# Altium schematic sheet 03_electrode_interface_new.SchDoc
size A3
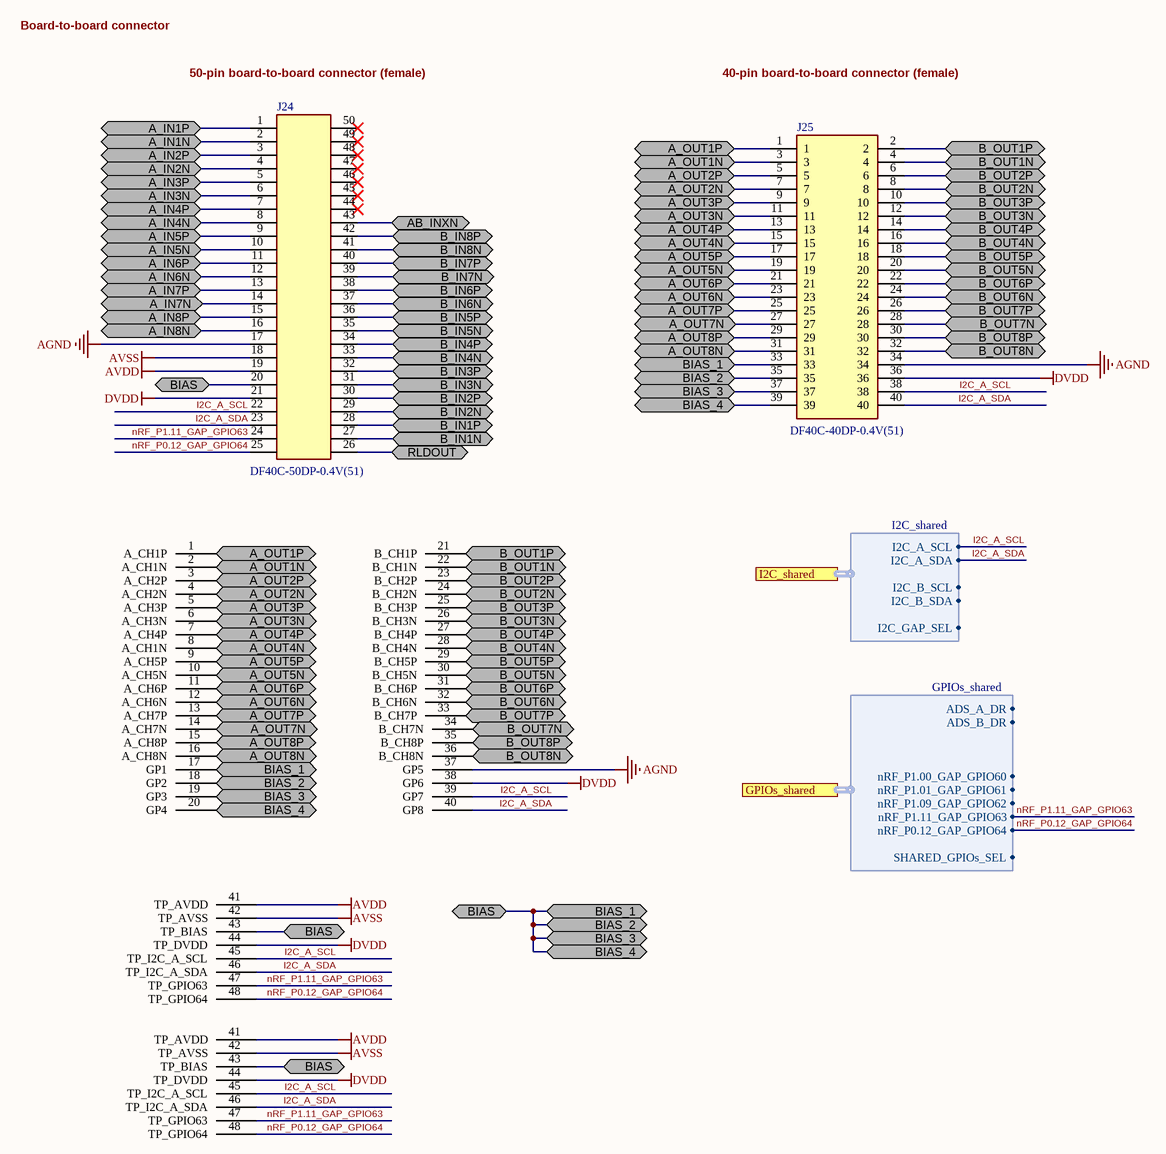
[diagram p0: 03_electrode_interface_new.SchDoc]

## Parts
AGND  0603_pad1_37  [0603_PAD_2 - duplicate37]  (value not drawn)
BIAS_1  0603_pad1_17  [0603_PAD_2 - duplicate17]  (value not drawn)
BIAS_2  0603_pad1_18  [0603_PAD_2 - duplicate18]  (value not drawn)
BIAS_3  0603_pad1_19  [0603_PAD_2 - duplicate19]  (value not drawn)
BIAS_4  0603_pad1_20  [0603_PAD_2 - duplicate20]  (value not drawn)
DVDD  0603_pad1_38  [0603_PAD_2 - duplicate38]  (value not drawn)
I2C_A_SCL  0603_pad1_39  [0603_PAD_2 - duplicate39]  (value not drawn)
I2C_A_SDA  0603_pad1_40  [0603_PAD_2 - duplicate40]  (value not drawn)
J24  DF40C-50DP-0.4V(51)  [CONN_COMBI_50P]
J25  DF40C-40DP-0.4V(51)  [FP-DF40C-40DP-0_4V_51-MFG]
J_A1N  0603_pad1_2  [0603_PAD_2 - duplicate2]  (value not drawn)
J_A1P  0603_pad1_1  [0603_PAD_2 - duplicate1]  (value not drawn)
J_A2N  0603_pad1_4  [0603_PAD_2 - duplicate4]  (value not drawn)
J_A2P  0603_pad1_3  [0603_PAD_2 - duplicate3]  (value not drawn)
J_A3N  0603_pad1_6  [0603_PAD_2 - duplicate6]  (value not drawn)
J_A3P  0603_pad1_5  [0603_PAD_2 - duplicate5]  (value not drawn)
J_A4N  0603_pad1_8  [0603_PAD_2 - duplicate8]  (value not drawn)
J_A4P  0603_pad1_7  [0603_PAD_2 - duplicate7]  (value not drawn)
J_A5N  0603_pad1_10  [0603_PAD_2 - duplicate10]  (value not drawn)
J_A5P  0603_pad1_9  [0603_PAD_2 - duplicate9]  (value not drawn)
J_A6N  0603_pad1_12  [0603_PAD_2 - duplicate12]  (value not drawn)
J_A6P  0603_pad1_11  [0603_PAD_2 - duplicate11]  (value not drawn)
J_A7N  0603_pad1_14  [0603_PAD_2 - duplicate14]  (value not drawn)
J_A7P  0603_pad1_13  [0603_PAD_2 - duplicate13]  (value not drawn)
J_A8N  0603_pad1_16  [0603_PAD_2 - duplicate16]  (value not drawn)
J_A8P  0603_pad1_15  [0603_PAD_2 - duplicate15]  (value not drawn)
J_B1N  0603_pad1_22  [0603_PAD_2 - duplicate22]  (value not drawn)
J_B1P  0603_pad1_21  [0603_PAD_2 - duplicate21]  (value not drawn)
J_B2N  0603_pad1_24  [0603_PAD_2 - duplicate24]  (value not drawn)
J_B2P  0603_pad1_23  [0603_PAD_2 - duplicate23]  (value not drawn)
J_B3N  0603_pad1_26  [0603_PAD_2 - duplicate26]  (value not drawn)
J_B3P  0603_pad1_25  [0603_PAD_2 - duplicate25]  (value not drawn)
J_B4N  0603_pad1_28  [0603_PAD_2 - duplicate28]  (value not drawn)
J_B4P  0603_pad1_27  [0603_PAD_2 - duplicate27]  (value not drawn)
J_B5N  0603_pad1_30  [0603_PAD_2 - duplicate30]  (value not drawn)
J_B5P  0603_pad1_29  [0603_PAD_2 - duplicate29]  (value not drawn)
J_B6N  0603_pad1_32  [0603_PAD_2 - duplicate32]  (value not drawn)
J_B6P  0603_pad1_31  [0603_PAD_2 - duplicate31]  (value not drawn)
J_B7N  0603_pad1_34  [0603_PAD_2 - duplicate34]  (value not drawn)
J_B7P  0603_pad1_33  [0603_PAD_2 - duplicate33]  (value not drawn)
J_B8N  0603_pad1_36  [0603_PAD_2 - duplicate36]  (value not drawn)
J_B8P  0603_pad1_35  [0603_PAD_2 - duplicate35]  (value not drawn)
TP_AVDD  TP_AVDD  [TP_AVDD]  (value not drawn)
TP_AVDD_1  TP_AVDD  [TP_AVDD]  (value not drawn)
TP_AVSS  TP_AVSS  [TP_AVSS]  (value not drawn)
TP_AVSS_1  TP_AVSS  [TP_AVSS]  (value not drawn)
TP_BIAS  TP_BIAS  [TP_BIAS]  (value not drawn)
TP_BIAS_1  TP_BIAS  [TP_BIAS]  (value not drawn)
TP_DVDD  TP_DVDD  [TP_DVDD]  (value not drawn)
TP_DVDD_1  TP_DVDD  [TP_DVDD]  (value not drawn)
TP_GPIO63  TP_GPIO63  [TP_GPIO63]  (value not drawn)
TP_GPIO63_1  TP_GPIO63  [TP_GPIO63]  (value not drawn)
TP_GPIO64  TP_GPIO64  [TP_GPIO64]  (value not drawn)
TP_GPIO64_1  TP_GPIO64  [TP_GPIO64]  (value not drawn)
TP_I2C_A_SCL  TP_I2C_A_SCL  [TP_I2C_A_SCL]  (value not drawn)
TP_I2C_A_SCL_1  TP_I2C_A_SCL  [TP_I2C_A_SCL]  (value not drawn)
TP_I2C_A_SDA  TP_I2C_A_SDA  [TP_I2C_A_SDA]  (value not drawn)
TP_I2C_A_SDA_1  TP_I2C_A_SDA  [TP_I2C_A_SDA]  (value not drawn)

## Ports
A_IN1N (bidir), A_IN1P (bidir), A_IN2N (bidir), A_IN2P (bidir), A_IN3N (bidir), A_IN3P (bidir), A_IN4N (bidir), A_IN4P (bidir), A_IN5N (bidir), A_IN5P (bidir), A_IN6N (bidir), A_IN6P (bidir), A_IN7N (bidir), A_IN7P (bidir), A_IN8N (bidir), A_IN8P (bidir), A_OUT1N (bidir), A_OUT1P (bidir), A_OUT2N (bidir), A_OUT2P (bidir), A_OUT3N (bidir), A_OUT3P (bidir), A_OUT4N (bidir), A_OUT4P (bidir), A_OUT5N (bidir), A_OUT5P (bidir), A_OUT6N (bidir), A_OUT6P (bidir), A_OUT7N (bidir), A_OUT7P (bidir), A_OUT8N (bidir), A_OUT8P (bidir), AB_INXN (bidir), B_IN1N (bidir), B_IN1P (bidir), B_IN2N (bidir), B_IN2P (bidir), B_IN3N (bidir), B_IN3P (bidir), B_IN4N (bidir), B_IN4P (bidir), B_IN5N (bidir), B_IN5P (bidir), B_IN6N (bidir), B_IN6P (bidir), B_IN7N (bidir), B_IN7P (bidir), B_IN8N (bidir), B_IN8P (bidir), B_OUT1N (bidir), B_OUT1P (bidir), B_OUT2N (bidir), B_OUT2P (bidir), B_OUT3N (bidir), B_OUT3P (bidir), B_OUT4N (bidir), B_OUT4P (bidir), B_OUT5N (bidir), B_OUT5P (bidir), B_OUT6N (bidir), B_OUT6P (bidir), B_OUT7N (bidir), B_OUT7P (bidir), B_OUT8N (bidir), B_OUT8P (bidir), BIAS (bidir), BIAS_1 (bidir), BIAS_2 (bidir), BIAS_3 (bidir), BIAS_4 (bidir), GPIOs_shared (harness GPIOs_shared), I2C_shared (harness I2C_shared), RLDOUT (bidir)

## Harnesses
GPIOs_shared: ADS_A_DR, ADS_B_DR, nRF_P1.00_GAP_GPIO60, nRF_P1.09_GAP_GPIO62, nRF_P1.11_GAP_GPIO63, nRF_P0.12_GAP_GPIO64, SHARED_GPIOs_SEL, nRF_P1.01_GAP_GPIO61
I2C_shared: I2C_A_SCL, I2C_A_SDA, I2C_B_SCL, I2C_B_SDA, I2C_GAP_SEL

## Nets
AGND: AGND.37(GP5) J24.17 J25.34
AVDD: J24.19 TP_AVDD.41(TP_AVDD) TP_AVDD_1.41(TP_AVDD)
AVSS: J24.18 TP_AVSS.42(TP_AVSS) TP_AVSS_1.42(TP_AVSS)
DVDD: DVDD.38(GP6) J24.21 J25.36 TP_DVDD.44(TP_DVDD) TP_DVDD_1.44(TP_DVDD)
A_IN1N: J24.2 ; port A_IN1N
A_IN1P: J24.1 ; port A_IN1P
A_IN2N: J24.4 ; port A_IN2N
A_IN2P: J24.3 ; port A_IN2P
A_IN3N: J24.6 ; port A_IN3N
A_IN3P: J24.5 ; port A_IN3P
A_IN4N: J24.8 ; port A_IN4N
A_IN4P: J24.7 ; port A_IN4P
A_IN5N: J24.10 ; port A_IN5N
A_IN5P: J24.9 ; port A_IN5P
A_IN6N: J24.12 ; port A_IN6N
A_IN6P: J24.11 ; port A_IN6P
A_IN7N: J24.14 ; port A_IN7N
A_IN7P: J24.13 ; port A_IN7P
A_IN8N: J24.16 ; port A_IN8N
A_IN8P: J24.15 ; port A_IN8P
A_OUT1N: J25.3 J_A1N.2(A_CH1N) ; port A_OUT1N
A_OUT1P: J25.1 J_A1P.1(A_CH1P) ; port A_OUT1P
A_OUT2N: J25.7 J_A2N.4(A_CH2N) ; port A_OUT2N
A_OUT2P: J25.5 J_A2P.3(A_CH2P) ; port A_OUT2P
A_OUT3N: J25.11 J_A3N.6(A_CH3N) ; port A_OUT3N
A_OUT3P: J25.9 J_A3P.5(A_CH3P) ; port A_OUT3P
A_OUT4N: J25.15 J_A4N.8(A_CH1N) ; port A_OUT4N
A_OUT4P: J25.13 J_A4P.7(A_CH4P) ; port A_OUT4P
A_OUT5N: J25.19 J_A5N.10(A_CH5N) ; port A_OUT5N
A_OUT5P: J25.17 J_A5P.9(A_CH5P) ; port A_OUT5P
A_OUT6N: J25.23 J_A6N.12(A_CH6N) ; port A_OUT6N
A_OUT6P: J25.21 J_A6P.11(A_CH6P) ; port A_OUT6P
A_OUT7N: J25.27 J_A7N.14(A_CH7N) ; port A_OUT7N
A_OUT7P: J25.25 J_A7P.13(A_CH7P) ; port A_OUT7P
A_OUT8N: J25.31 J_A8N.16(A_CH8N) ; port A_OUT8N
A_OUT8P: J25.29 J_A8P.15(A_CH8P) ; port A_OUT8P
AB_INXN: J24.43 ; port AB_INXN
B_IN1N: J24.27 ; port B_IN1N
B_IN1P: J24.28 ; port B_IN1P
B_IN2N: J24.29 ; port B_IN2N
B_IN2P: J24.30 ; port B_IN2P
B_IN3N: J24.31 ; port B_IN3N
B_IN3P: J24.32 ; port B_IN3P
B_IN4N: J24.33 ; port B_IN4N
B_IN4P: J24.34 ; port B_IN4P
B_IN5N: J24.35 ; port B_IN5N
B_IN5P: J24.36 ; port B_IN5P
B_IN6N: J24.37 ; port B_IN6N
B_IN6P: J24.38 ; port B_IN6P
B_IN7N: J24.39 ; port B_IN7N
B_IN7P: J24.40 ; port B_IN7P
B_IN8N: J24.41 ; port B_IN8N
B_IN8P: J24.42 ; port B_IN8P
B_OUT1N: J25.4 J_B1N.22(B_CH1N) ; port B_OUT1N
B_OUT1P: J25.2 J_B1P.21(B_CH1P) ; port B_OUT1P
B_OUT2N: J25.8 J_B2N.24(B_CH2N) ; port B_OUT2N
B_OUT2P: J25.6 J_B2P.23(B_CH2P) ; port B_OUT2P
B_OUT3N: J25.12 J_B3N.26(B_CH3N) ; port B_OUT3N
B_OUT3P: J25.10 J_B3P.25(B_CH3P) ; port B_OUT3P
B_OUT4N: J25.16 J_B4N.28(B_CH4N) ; port B_OUT4N
B_OUT4P: J25.14 J_B4P.27(B_CH4P) ; port B_OUT4P
B_OUT5N: J25.20 J_B5N.30(B_CH5N) ; port B_OUT5N
B_OUT5P: J25.18 J_B5P.29(B_CH5P) ; port B_OUT5P
B_OUT6N: J25.24 J_B6N.32(B_CH6N) ; port B_OUT6N
B_OUT6P: J25.22 J_B6P.31(B_CH6P) ; port B_OUT6P
B_OUT7N: J25.28 J_B7N.34(B_CH7N) ; port B_OUT7N
B_OUT7P: J25.26 J_B7P.33(B_CH7P) ; port B_OUT7P
B_OUT8N: J25.32 J_B8N.36(B_CH8N) ; port B_OUT8N
B_OUT8P: J25.30 J_B8P.35(B_CH8P) ; port B_OUT8P
BIAS: BIAS_1.17(GP1) BIAS_2.18(GP2) BIAS_3.19(GP3) BIAS_4.20(GP4) J24.20 J25.33 J25.35 J25.37 J25.39 TP_BIAS.43(TP_BIAS) TP_BIAS_1.43(TP_BIAS) ; port BIAS, port BIAS_2, port BIAS_3, port BIAS_4, port BIAS_1
I2C_A_SCL: I2C_A_SCL.39(GP7) J24.22 J25.38 TP_I2C_A_SCL.45(TP_I2C_A_SCL) TP_I2C_A_SCL_1.45(TP_I2C_A_SCL) ; port I2C_shared.I2C_A_SCL
I2C_A_SDA: I2C_A_SDA.40(GP8) J24.23 J25.40 TP_I2C_A_SDA.46(TP_I2C_A_SDA) TP_I2C_A_SDA_1.46(TP_I2C_A_SDA) ; port I2C_shared.I2C_A_SDA
nRF_P0.12_GAP_GPIO64: J24.25 TP_GPIO64.48(TP_GPIO64) TP_GPIO64_1.48(TP_GPIO64) ; port GPIOs_shared.nRF_P0.12_GAP_GPIO64
nRF_P1.11_GAP_GPIO63: J24.24 TP_GPIO63.47(TP_GPIO63) TP_GPIO63_1.47(TP_GPIO63) ; port GPIOs_shared.nRF_P1.11_GAP_GPIO63
RLDOUT: J24.26 ; port RLDOUT

Not connected (* = marked no-connect by the designer): J24 44* 45* 46* 47* 48* 49* 50*

## Notes on the sheet
- Board-to-board connector
- (near J24) 50-pin board-to-board connector (female)
- 40-pin board-to-board connector (female)
- 1
- 2
- 3
- 4
- 5
- 6
- 7
- 8
- A
- B
- C
- D
- Project:
- Date:
- Drawing number:
- Rev:
- Format:
- A3
- Drawn by:
- Laboratory:
- Page
- Sheet:
- of
- File:

## Library data of the parts
J24 = DF40C-50DP-0.4V(51): 50 Position 0.4mm Pitch Dual Row Vertical Surface Mount (SMT) Receptacle,; Mfr_Name: Hirose; System: Connector; Copyright: Copyright (C) 2023 Ultra Librarian. All rights reserved.; Manufacturer_Part_Number: DF40C-50DP-0.4V(51); RefDes: RefDes; Type: DEV
J25 = DF40C-40DP-0.4V(51): 50 Position 0.4mm Pitch Dual Row Vertical Surface Mount (SMT) Receptacle; Connector Type: Plug; Number of Contacts: 40; Gender: Male; Voltage Rating: 30V; Mated Stacking Heights: 4mm; Current Rating: 300mA; System: Connector; Lead Free: Lead Free; Number of Positions: 40; Packaging: Tape and Reel; Contact Plating: Gold; REACH SVHC: No SVHC; Mount: Surface Mount; Orientation: Straight; Housing Material: Polymer; Termination: SMD/SMT; Min Operating Temperature: -35°C; Number of Rows: 2; Max Operating Temperature: 85°C; Pitch: 0.4mm; Contact Material: Bronze; Package Quantity: 1